# Altium project Nixie_Tube_IN-9_Clock.PrjPcb
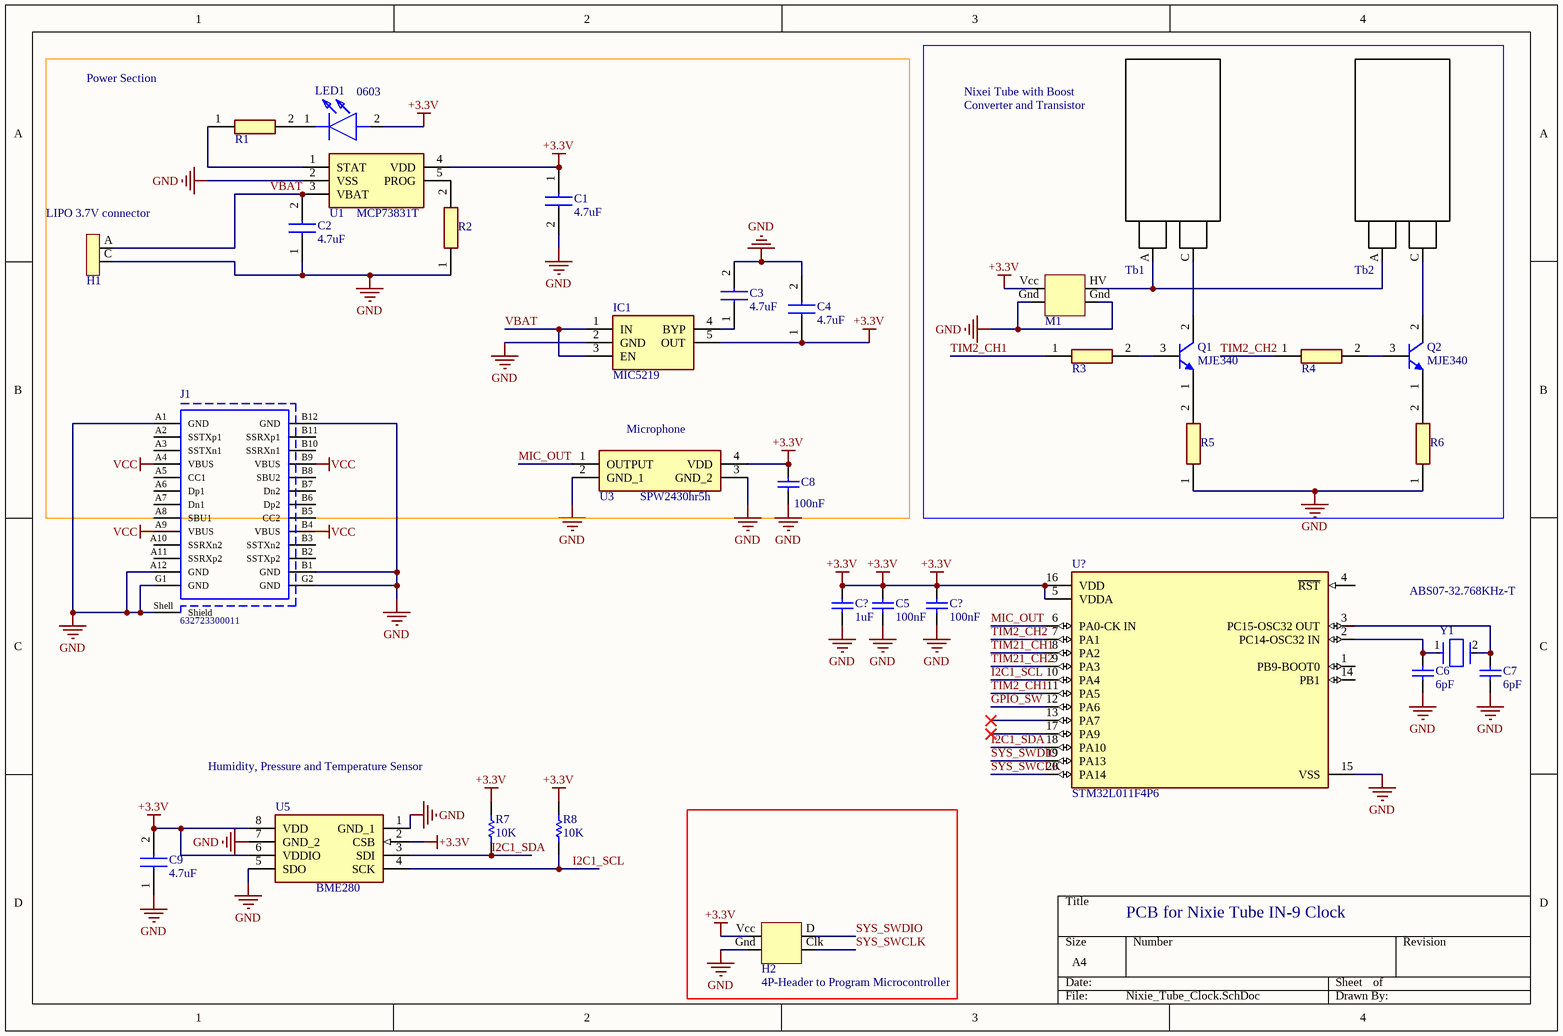
[diagram p0: Nixie_Tube_Clock.SchDoc]
1 sheet, 34 parts. Net scope: global (net labels, ports and power ports of the same name join across sheets).

## Sheet Nixie_Tube_Clock.SchDoc
size A4

### Parts
(Parts that share a designator on the sheet are numbered #1, #2 ... from top to bottom, then left to right.)
C1  4.7uF  [CAP_0603]
C2  4.7uF  [CAP_0603]
C3  4.7uF  [CAP_0603]
C4  4.7uF  [CAP_0603]
C5  100nF  [CAPC1608X90X35ML10T15]
C6  6pF  [CAPC1608X90X35ML10T15]
C7  6pF  [CAPC1608X90X35ML10T15]
C8  100nF  [CAPC1608X90X35ML10T15]
C9  4.7uF  [CAP_0603]
C?#1  1uF  [CAPC1608X90X35ML10T15]
C?#2  100nF  [CAPC1608X90X35ML10T15]
H1  Header 2-P  [2p]  (value not drawn)
H2  Program  [4P]  (value not drawn)
IC1  MIC5219  [sot95p2]
J1  632723300011  [632723300011]
LED1  0603  [led_0603]
M1  Boost_Converter  [Boost_Converter]  (value not drawn)
Q1  MJE340  [ONSC-TO-225-3-77-09]
Q2  MJE340  [ONSC-TO-225-3-77-09]
R1  470Ω  [RES_0603]  (value not drawn)
R2  470Ω  [RES_0603]  (value not drawn)
R3  470Ω  [RES_0603]  (value not drawn)
R4  470Ω  [RES_0603]  (value not drawn)
R5  470Ω  [RES_0603]  (value not drawn)
R6  470Ω  [RES_0603]  (value not drawn)
R7  10K  [RESC1609X50X30LL8T20]
R8  10K  [RESC1609X50X30LL8T20]
Tb1  IN-09_Tube  [NixeiTube]  (value not drawn)
Tb2  IN-09_Tube  [NixeiTube]  (value not drawn)
U1  MCP73831T  [SOT95P270X145-5N]
U3  SPW2430hr5h  [SPW2430HR5HB]
U5  BME280  [BME280]
U?  STM32L011F4P6  [FP-TSSOP20-YA-MFG]
Y1  ABS07-32.768KHz-T  [FP-ABS07-MFG]

### Blocks framed on the sheet
4P-Header to Program Microcontroller: H2

### Nets
+3.3V: C1.1 C4.1 C5.2 C8.2 C9.2 C?#1.2 C?#2.2 H2.Vcc IC1.5(OUT) LED1.2(A) M1.Vcc R7.2 R8.2 U1.4(VDD) U3.4(VDD) U5.2(CSB) U5.6(VDDIO) U5.8(VDD) U?.5(VDDA) U?.16(VDD)
GND: C1.2 C2.1 C3.2 C4.2 C5.1 C6.1 C7.1 C8.1 C9.1 C?#1.1 C?#2.1 H1.C H2.Gnd IC1.2(GND) J1.A1(GND) J1.A12(GND) J1.B1(GND) J1.B12(GND) J1.G1(GND) J1.G2(GND) J1.Shell(Shield) M1.Gnd R2.1 R5.1 R6.1 U1.2(VSS) U3.2(GND_1) U3.3(GND_2) U5.1(GND_1) U5.5(SDO) U5.7(GND_2) U?.15(VSS)
VCC: J1.A4(VBUS) J1.A9(VBUS) J1.B4(VBUS) J1.B9(VBUS)
GPIO_SW: U?.12(PA6)
I2C1_SCL: R8.1 U5.4(SCK) U?.10(PA4)
I2C1_SDA: R7.1 U5.3(SDI) U?.18(PA10)
MIC_OUT: U3.1(OUTPUT) U?.6(PA0-CK_IN)
SYS_SWCLK: H2.Clk U?.20(PA14)
SYS_SWDIO: H2.D U?.19(PA13)
TIM2_CH1: R3.1 U?.11(PA5)
TIM2_CH2: R4.1 U?.7(PA1)
TIM21_CH1: U?.8(PA2)
TIM21_CH2: U?.9(PA3)
VBAT: C2.2 H1.A IC1.1(IN) IC1.3(EN) U1.3(VBAT)
NetC3_1: C3.1 IC1.4(BYP)
NetC6_2: C6.2 U?.2(PC14-OSC32_IN) Y1.1
NetC7_2: C7.2 U?.3(PC15-OSC32_OUT) Y1.2
NetLED1_1: LED1.1(K) R1.2
NetM1_HV: M1.HV Tb1.A Tb2.A
NetQ1_1: Q1.1(E) R5.2
NetQ1_2: Q1.2(C) Tb1.C
NetQ1_3: Q1.3(B) R3.2
NetQ2_1: Q2.1(E) R6.2
NetQ2_2: Q2.2(C) Tb2.C
NetQ2_3: Q2.3(B) R4.2
NetR1_1: R1.1 U1.1(STAT)
NetR2_2: R2.2 U1.5(PROG)

Not connected (* = marked no-connect by the designer): J1 A2(SSTXp1) A3(SSTXn1) A5(CC1) A6(Dp1) A7(Dn1) A8(SBU1) A10(SSRXn2) A11(SSRXp2) B2(SSTXp2) B3(SSTXn2) B5(CC2) B6(Dp2) B7(Dn2) B8(SBU2) B10(SSRXn1) B11(SSRXp1); U? 1(PB9-BOOT0) 4(~{RST}) 13(PA7)* 14(PB1) 17(PA9)*

### Notes on the sheet
- Power Section
- Nixei Tube with Boost
- Converter and Transistor
- (near H1) LIPO 3.7V connector
- (near U3) Microphone
- Humidity, Pressure and Temperature Sensor
- PCB for Nixie Tube IN-9 Clock

### Library data of the parts
C1-C4 C9 = Cap_0603
C5 C8 C?#2 = CMP-2000-04945-1: Chip Capacitor, 100nF , +/- 5%, 50 V, -55 to 125 degC, 0603 (1608 Metric), RoHS, Tape and Reel; Manufacturer: Murata; Capacitance: 22pF; Rated Voltage: 50V; Dielectric: C0G; Manufacturer URL: http://www.murata.com/; Datasheet Version: Jul-06; Package Reference: 603; Tolerance (%): ±5%; Case Size/Dimension: 0603; Package Description: 2-Pin Surface Mount Device, Body 1.6 x 0.8 mm; Datasheet URL: https://datasheet.ciiva.com/11786/0900766b807a1cab-11786398.pdf
C6 C7 = CMP-2000-04945-1: Chip Capacitor, 22 pF, +/- 5%, 50 V, -55 to 125 degC, 0603 (1608 Metric), RoHS, Tape and Reel; Manufacturer: Murata; Capacitance: 22pF; Rated Voltage: 50V; Dielectric: C0G; Manufacturer URL: http://www.murata.com/; Datasheet Version: Jul-06; Package Reference: 603; Tolerance (%): ±5%; Case Size/Dimension: 0603; Package Description: 2-Pin Surface Mount Device, Body 1.6 x 0.8 mm; Datasheet URL: https://datasheet.ciiva.com/11786/0900766b807a1cab-11786398.pdf
C?#1 = CMP-2000-04945-1: Chip Capacitor, 1uF , +/- 5%, 50 V, -55 to 125 degC, 0603 (1608 Metric), RoHS, Tape and Reel; Manufacturer: Murata; Capacitance: 22pF; Rated Voltage: 50V; Dielectric: C0G; Manufacturer URL: http://www.murata.com/; Datasheet Version: Jul-06; Package Reference: 603; Tolerance (%): ±5%; Case Size/Dimension: 0603; Package Description: 2-Pin Surface Mount Device, Body 1.6 x 0.8 mm; Datasheet URL: https://datasheet.ciiva.com/11786/0900766b807a1cab-11786398.pdf
J1 = CMP-1502-03214-1: USB 3.1 Type C Receptacle WR-COM, Horizontal, SMT / THT; Manufacturer: Wurth Elektronik; Rated Current: 5A; Contact Resistance: 30mOhm; Working Voltage: 20VDC; Operating Temperature: -40to105degC; Package Reference: 632723300011; Datasheet URL: https://katalog.we-online.de/em/datasheet/632723x00011%282%29.pdf; Manufacturer URL: http://www.we-online.de; Connector Type: USB3.1TypeC; Gender: Receptacle; Part Number: 632723300011; Mounting Technology: SMT/THT; Publisher: WurthElektronik; Packaging: TapeandReel; Orientation: Horizontal
LED1 = LW_Q38G-Q1OO-3K6L-1-5-R18: LED; Manufacturer_Name: OSRAM; Manufacturer_Part_Number: LW Q38G-Q1OO-3K6L-1-5-R18; Datasheet Link: https://dammedia.osram.info/media/resource/hires/osram-dam-5178045/LW%20Q38G_EN.pdf; Height: 0.4mm
Q1 Q2 = CMP-1048-01251-1: Plastic Medium-Power NPN Silicon Transistor, 3-Pin TO-225, Bulk Box; Manufacturer: On Semiconductor; IC Continuous (A): 0.5; Note1: 0; PackageVersion: Rev. AC, 12/2013; PartNumber: MJE340; RoHS: FALSE; ComponentLink2Description: Datasheet; ComponentLink2URL: http://www.onsemi.com/pub_link/Collateral/MJE340-D.PDF; Mounting Technology: Through Hole; Packing: Bulk Box; DatasheetVersion: Rev. 12; PackageReference: TO-225-3-77-09; ComponentLink3URL: http://www.onsemi.com/pub_link/Collateral/77-09.PDF; ComponentLink1URL: http://www.onsemi.com/; Polarity: NPN; ComponentLink3Description: Package Specification; PackageDescription: 3-Pin Flange Mount, Vertical Straight Lead, Body 7.6 x 2.7 mm, Pitch 2.29 mm; ComponentLink1Description: Manufacturer URL
R1-R6 = RES 0603
R7 R8 = CMP-2000-03816-5: Chip Resistor, 0 Ohm, Jumper, 100 mW, -55 to 155 degC, 0603 (1608 Metric), RoHS, Tape and Reel; Manufacturer: Vishay Semiconductor; Voltage Rating: 75 V; Package Quantity: 5000; DatasheetVersion: 06/2012; Min Operating Temperature: -55 degC; ComponentLink1URL: http://www.vishay.com/; Mounting Technology: Surface Mount; Height: 0.45 mm; ComponentLink1Description: Manufacturer URL; REACH SVHC: Unknown; PackageReference: 0603; Packaging: Tape and Reel; Max Operating Temperature: 155 degC; Mount: Surface Mount; ComponentLink2Description: Datasheet; PackageDescription: 2-Pin Surface Mount Device, Body 1.575 x 0.85 mm; Length: 1.55 mm; ComponentLink2URL: http://www.vishay.com/docs/20035/dcrcwe3.pdf; Pins: 2; RoHSCompliant: true
U? = CMP-12105-000130-1: IC MCU 32BIT 16KB FLASH 20TSSOP; Frequency: 32MHz; Oscillator Type: Internal; Peripherals: Brown-out Detect/Reset; Number of I/Os: 16; Core Architecture: ARM; Interface: I2C; Lead Free: Lead Free; Min Operating Temperature: -40°C; RoHS Compliant: Yes; Case/Package: TSSOP; Number of Pins: 20; Max Operating Temperature: 85°C; Memory Type: FLASH; Packaging: Rail/Tube; Memory Size: 16KB
Y1 = CMP-0447-00001-3: CRYSTAL 32.7680KHZ 12.5PF SMD; Frequency Tolerance: 20ppm; Series Resistance: 70kR; Operating Frequency: 32.768 kHz; Number of Pins: 2; Package Quantity: 3000; Tolerance: 20ppm; Max Operating Temperature: 85°C; Width: 0.061inch; Frequency: 32.768kHz; Termination: SMD/SMT; Min Operating Temperature: -40°C; Radiation Hardening: No; Series: ABS07; Length: 3.2mm; Case/Package: CSMD; ESR (Equivalent Series Resistance): 70kR; RoHS Compliant: Yes; Load Capacitance: 12.5pF; Depth: 1.5mm; REACH SVHC: No SVHC; Height: 0.035inch; Packaging: Tape and Reel; Lead Free: Lead Free